# EAGLE design Reflow-A-Tron (EAGLE 7.7.0)
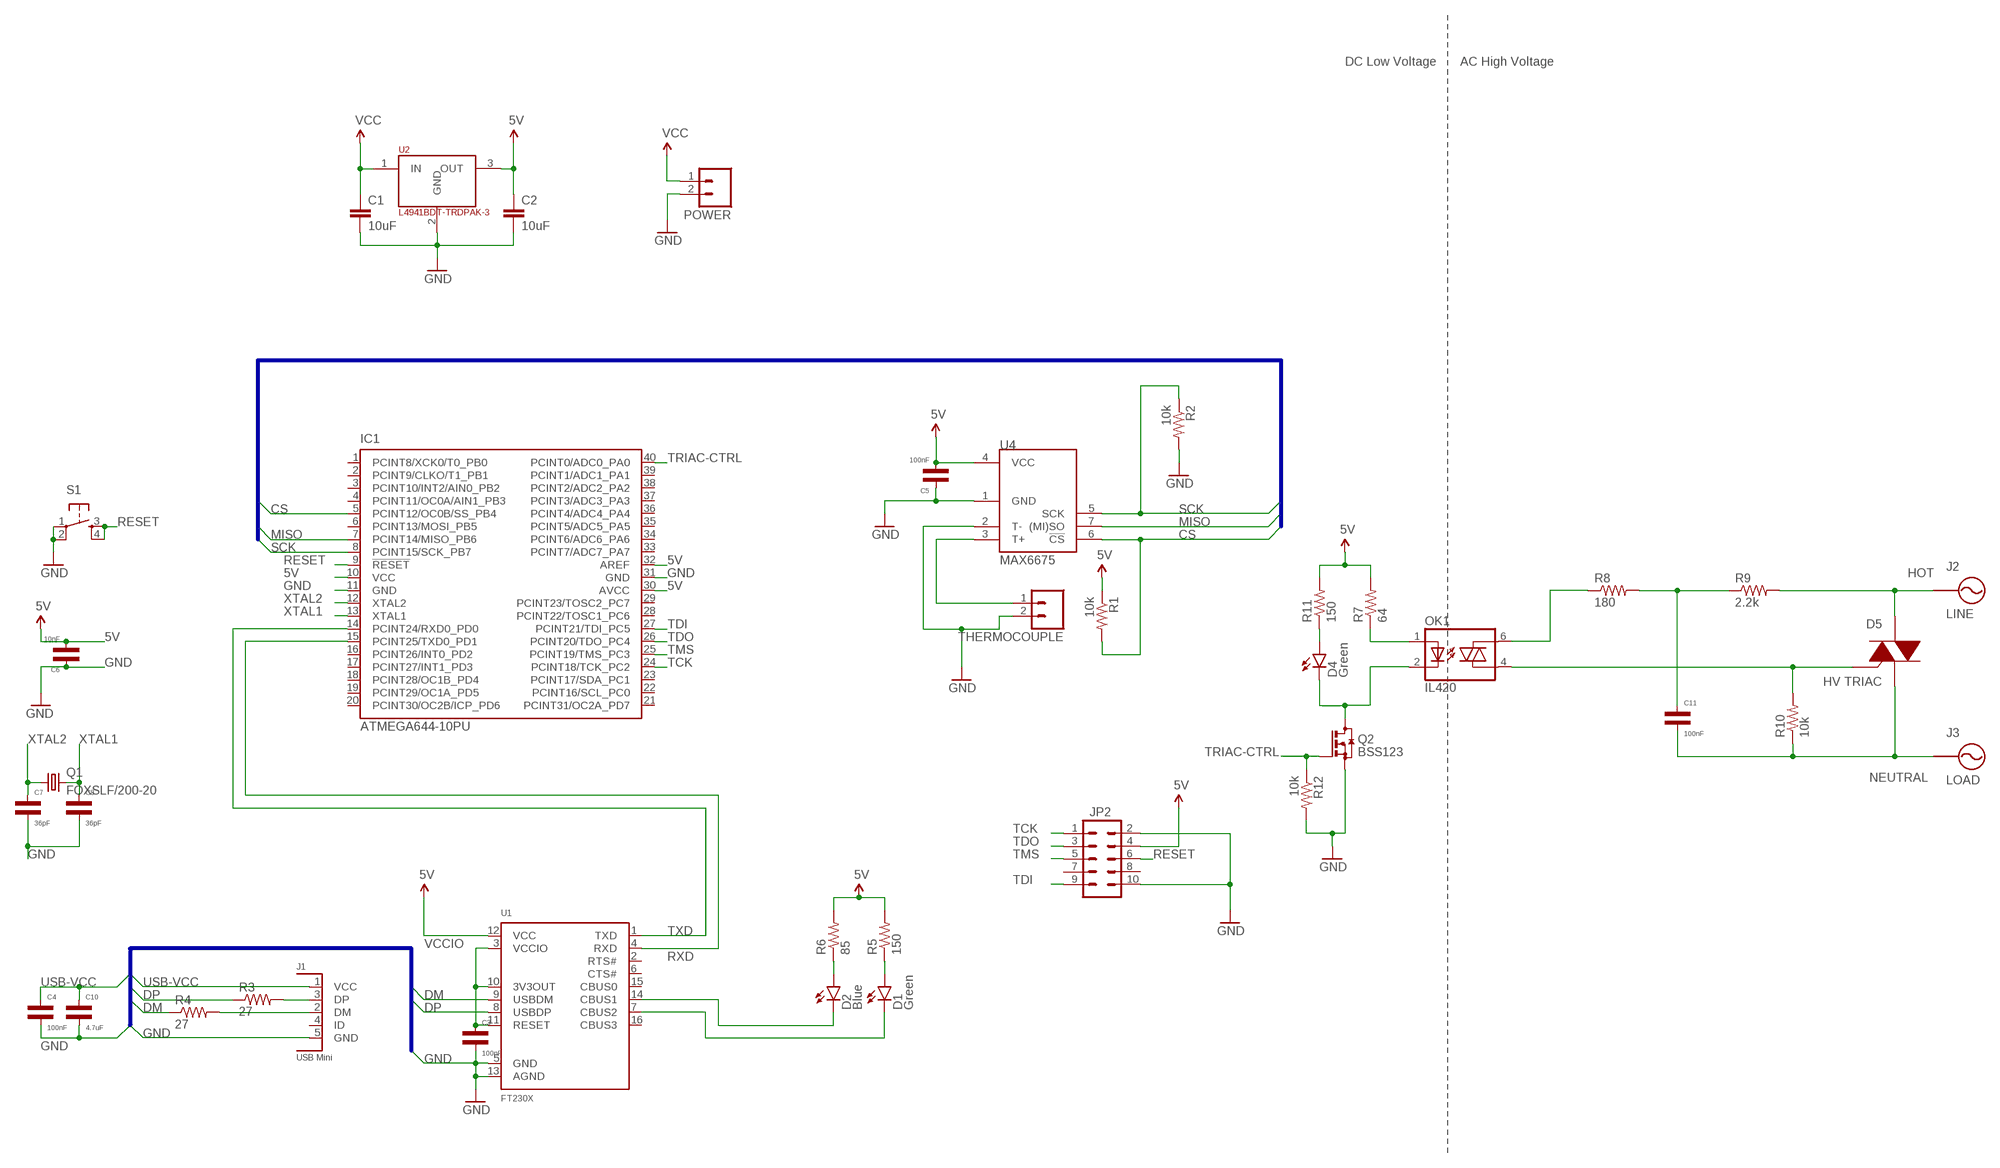
[diagram p0: schematic, sheet 1]

## Parts
C1  10uF  10UF50V20%(1210)  [1210]
C2  10uF  10UF50V20%(1210)  [1210]
C3  100nF  SMD-CAP-0805  [0805]
C4  100nF  SMD-CAP-0805  [0805]
C5  100nF  SMD-CAP-0805  [0805]
C6  10nF  SMD-CAP-0805  [0805]
C7  36pF  SMD-CAP-0805  [0805]
C8  36pF  SMD-CAP-0805  [0805]
C10  4.7uF  SMD-CAP-0805  [0805]
C11  100nF  SMD-CAP-0805  [0805]
D1  Green  LED1206  [LED-1206]
D2  Blue  LED1206  [LED-1206]
D4  Green  LED1206  [LED-1206]
D5  HV TRIAC  T1250H  [D2PAK]
IC1  ATMEGA644-10PU  [DIL40]
J1  USB Mini  XM7D-0512  [XM7D-0512]
J2  LINE  8191  [8191]
J3  LOAD  8191  [8191]
JP2  M05X2PTH  [AVR_ICSP]
OK1  IL420  [DIL06]
POWER  M025MM  [SCREWTERMINAL-5MM-2]
Q1  FOXSLF/200-20  CRYSTALHC49S  [HC49/S]
Q2  BSS123  [SOT23]
R1  10k  R-US_R0805  [R0805]
R2  10k  R-US_R0805  [R0805]
R3  27  R-US_M0805  [M0805]
R4  27  R-US_M0805  [M0805]
R5  150  R-US_R0805  [R0805]
R6  85  R-US_R0805  [R0805]
R7  64  R-US_R0805  [R0805]
R8  180  R-US_R0805  [R0805]
R9  2.2k  R-US_R0805  [R0805]
R10  10k  R-US_R0805  [R0805]
R11  150  R-US_R0805  [R0805]
R12  10k  R-US_R0805  [R0805]
S1  TAC_SWITCHPTH  [TACTILE-PTH]
THERMOCOUPLE  M023.5MM  [SCREWTERMINAL-3.5MM-2]
U1  FT230X  [SSOP-16]
U2  L4941BDT-TRDPAK-3  [DPAK]
U4  MAX6675  [SOIC8]

## Nets
5V: C2.1 C5.1 C6.1 IC1.10(VCC) IC1.30(AVCC) IC1.32(AREF) JP2.4 R1.1 R5.2 R6.2 R7.2 R11.2 U1.12(VCC) U2.3(OUT) U4.4(VCC)
CS: IC1.5(PCINT12/OC0B/SS_PB4) R1.2 U4.6(!CS)
DM: R4.1 U1.9(USBDM)
DP: R3.1 U1.8(USBDP)
GND: C1.2 C2.2 C3.1 C4.1 C5.2 C6.2 C7.1 C8.1 C10.1 IC1.11(GND) IC1.31(GND) J1.5(GND) JP2.2 JP2.10 POWER.2 Q2.2(S) R2.2 R12.2 S1.1 S1.2 THERMOCOUPLE.2 U1.5(GND) U1.13(AGND) U2.2(GND) U4.1(GND) U4.2(T-)
HOT: D5.4(A2) J2.1 J2.2 J2.3 J2.4 R9.2
MISO: IC1.7(PCINT14/MISO_PB6) U4.7((MI)SO)
N$3: J1.2(DM) R4.2
N$4: J1.3(DP) R3.2
N$5: D1.A R5.1
N$6: D2.A R6.1
N$7: D2.C U1.14(CBUS1)
N$8: D1.C U1.7(CBUS2)
N$12: OK1.6(A2) R8.1
N$13: OK1.1(A) R7.1
N$14: D5.3(G) OK1.4(A1) R10.2
N$15: C11.2 R8.2 R9.1
N$19: D4.C OK1.2(C) Q2.3(D)
N$20: D4.A R11.1
NEUTRAL: C11.1 D5.1(A1) J3.1 J3.2 J3.3 J3.4 R10.1
RESET: IC1.9(!RESET) JP2.6 S1.3 S1.4
RXD: IC1.15(PCINT25/TXD0_PD1) U1.4(RXD)
SCK: IC1.8(PCINT15/SCK_PB7) R2.1 U4.5(SCK)
T+: THERMOCOUPLE.1 U4.3(T+)
TCK: IC1.24(PCINT18/TCK_PC2) JP2.1
TDI: IC1.27(PCINT21/TDI_PC5) JP2.9
TDO: IC1.26(PCINT20/TDO_PC4) JP2.3
TMS: IC1.25(PCINT19/TMS_PC3) JP2.5
TRIAC-CTRL: IC1.40(PCINT0/ADC0_PA0) Q2.1(G) R12.1
TXD: IC1.14(PCINT24/RXD0_PD0) U1.1(TXD)
USB-VCC: C4.2 C10.2 J1.1(VCC)
VCC: C1.1 POWER.1 U2.1(IN)
VCCIO: C3.2 U1.3(VCCIO) U1.10(3V3OUT) U1.11(RESET)
XTAL1: C8.2 IC1.13(XTAL1) Q1.2
XTAL2: C7.2 IC1.12(XTAL2) Q1.1
Unconnected: IC1.1(PCINT8/XCK0/T0_PB0) IC1.2(PCINT9/CLKO/T1_PB1) IC1.3(PCINT10/INT2/AIN0_PB2) IC1.4(PCINT11/OC0A/AIN1_PB3) IC1.6(PCINT13/MOSI_PB5) IC1.16(PCINT26/INT0_PD2) IC1.17(PCINT27/INT1_PD3) IC1.18(PCINT28/OC1B_PD4) IC1.19(PCINT29/OC1A_PD5) IC1.20(PCINT30/OC2B/ICP_PD6) IC1.21(PCINT31/OC2A_PD7) IC1.22(PCINT16/SCL_PC0) IC1.23(PCINT17/SDA_PC1) IC1.28(PCINT22/TOSC1_PC6) IC1.29(PCINT23/TOSC2_PC7) IC1.33(PCINT7/ADC7_PA7) IC1.34(PCINT6/ADC6_PA6) IC1.35(PCINT5/ADC5_PA5) IC1.36(PCINT4/ADC4_PA4) IC1.37(PCINT3/ADC3_PA3) IC1.38(PCINT2/ADC2_PA2) IC1.39(PCINT1/ADC1_PA1) J1.4(ID) JP2.7 JP2.8 U1.2(RTS#) U1.6(CTS#) U1.15(CBUS0) U1.16(CBUS3)

## Buses
CS,MISO,SCK
USB-VCC,DP,DM,GND

## Notes on the sheet
- DC Low Voltage | AC High Voltage

## Library data of the parts
C1 C2 = SparkFun-Capacitors:10UF50V20%(1210): CAP-09824; PROD_ID: CAP-09824
C3 C4 C7 C8 C10 C11 = neilbetham:SMD-CAP: Unpolarized SMD Capacitor; VALUE: 10nF
C5 = custom:SMD-CAP: Unpolarized SMD Capacitor; VALUE: 10nF
C6 = custom:SMD-CAP: Unpolarized SMD Capacitor
D1 D2 D4 = SparkFun-LED:LED: LEDs Standard schematic elements and footprints for 5mm, 3mm, 1206, and 0603 sized LEDs. 5mm - Spark Fun Electronics SKU : COM-00529 (and others)
D5 = custom:T1250H: 12A RMS 600V Triac http://www.mouser.com/ProductDetail/STMicroelectronics/T1250H-6G/?qs=sGAEpiMZZMuAO0%252bGuNbnQkk12h2fQRpPEeRH2FvLW2U%3d
IC1 = atmel:ATMEGA644-*PU: 8-bit Microcontroller with 64K Bytes In-System Programmable Flash Auto generated by make-symbol-device-package-bsdl.ulp Rev. 34 Source: http://www.atmel.com/dyn/resources/prod_documents/doc2593.pdf; MPN: ATMEGA644V-10PU; OC_FARNELL: 1288342; OC_NEWARK: 23M5062
J1 = custom:XM7D-0512
J2 J3 = neilbetham:8191: Screw Terminal 6-32 Thread
JP2 = SparkFun-Connectors:M05X2: Header 5x2 Standard 10-pin dual row 0.1" header. Commonly used with AVR-ISP. Use with Spark Fun Electronics SKU: PRT-00778
OK1 = optocoupler:IL420: SIEMENS OPTO COUPLER; MF: VISHAY/TELEFUNKEN; MPN: IL420; OC_FARNELL: 1469561; OC_NEWARK: 58K1719
POWER = SparkFun-Connectors:M02: Standard 2-pin 0.1" header. Use with - straight break away headers ( PRT-00116) - right angle break away headers (PRT-00553) - swiss pins (PRT-00743) - machine pins (PRT-00117) - female headers (PRT-00115) Molex polarized connector foot print use with: PRT-08233 with associated crimp pins and housings. 2.54_SCREWTERM for use with PRT-10571. 3.5mm Screw Terminal footprints for PRT-08084 5mm Screw Terminal footprints for use with PRT-08432; STOREFRONT_ID: PRT-08432
Q1 = crystal:CRYSTAL: CRYSTAL; OC_FARNELL: 1667008; OC_NEWARK: unknown
Q2 = transistor-small-signal:BSS123: N-CHANNEL MOS FET
R1-R12 = resistor:R-US_: RESISTOR, American symbol
S1 = SparkFun-Retired:TAC_SWITCH: Momentary Switch Button commonly used for reset or general input. Spark Fun Electronics SKU : COM-00097 SMT- SWCH-08247
THERMOCOUPLE = SparkFun-Connectors:M02: Standard 2-pin 0.1" header. Use with - straight break away headers ( PRT-00116) - right angle break away headers (PRT-00553) - swiss pins (PRT-00743) - machine pins (PRT-00117) - female headers (PRT-00115) Molex polarized connector foot print use with: PRT-08233 with associated crimp pins and housings. 2.54_SCREWTERM for use with PRT-10571. 3.5mm Screw Terminal footprints for PRT-08084 5mm Screw Terminal footprints for use with PRT-08432; PROD_ID: CONN-08399
U1 = custom:FT230X
U2 = neilbetham:L4941BDT-TR: 5V 1A Voltage Regulator. Input max voltage of 16V. Dropout voltage .25v @ 500mA
U4 = SparkFun-AnalogIC:MAX6675: Cold-Junction-Compensated K-Thermocoupleto-Digital Converter (0°C to +1024°C) The MAX6675 performs cold-junction compensation and digitizes the signal from a type-K thermocouple. The data is output in a 12-bit resolution, SPI™-compatible, read-only format. This converter resolves temperatures to 0.25°C, allows readings as high as +1024°C, and exhibits thermocouple accuracy of 8LSBs for temperatures ranging from 0°C to +700°C.; PROD_ID: IC-12512

## Board
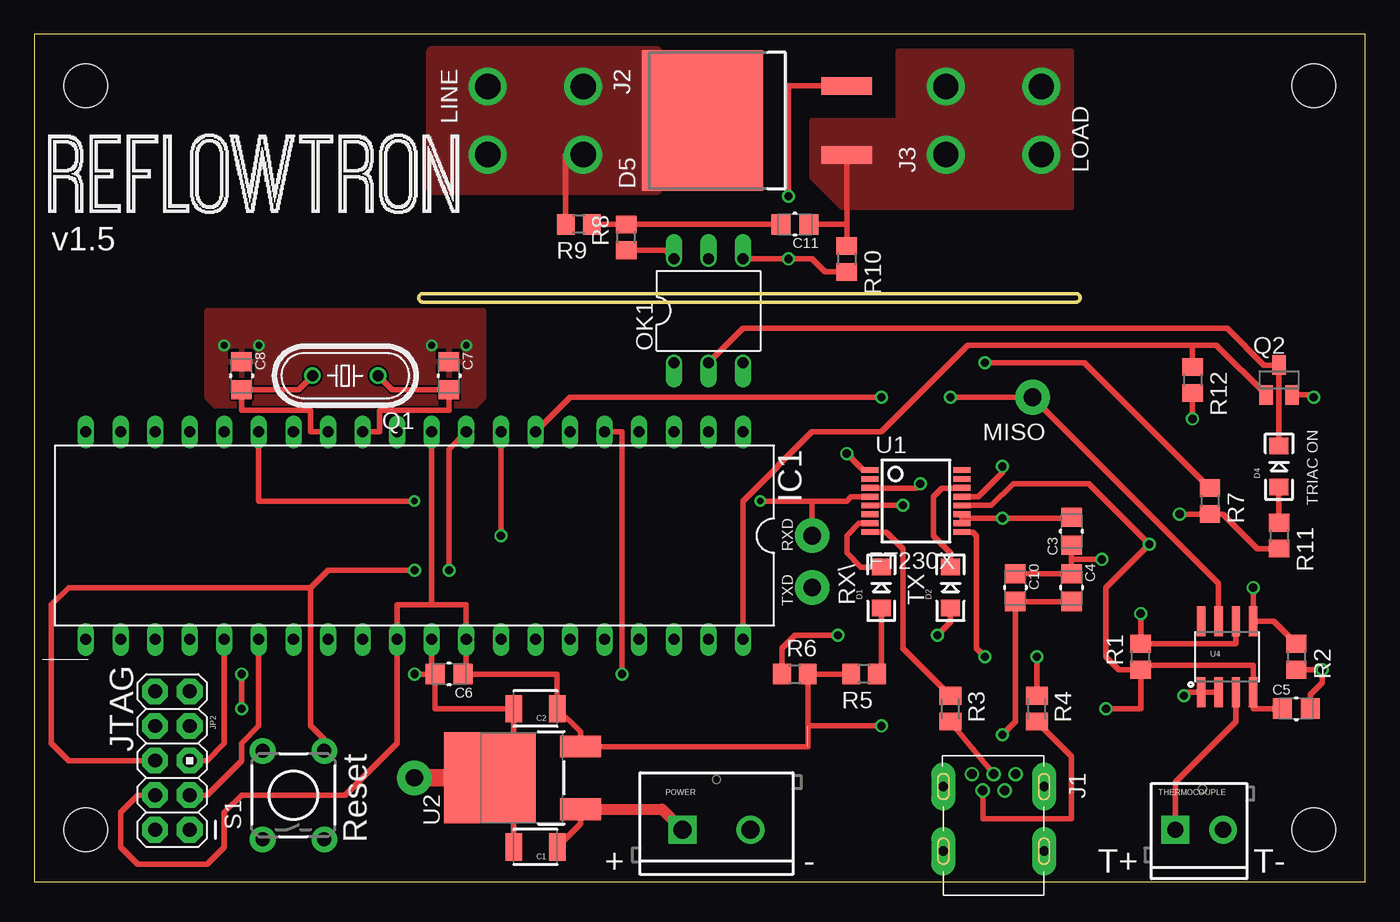
[diagram p1: board, top side]
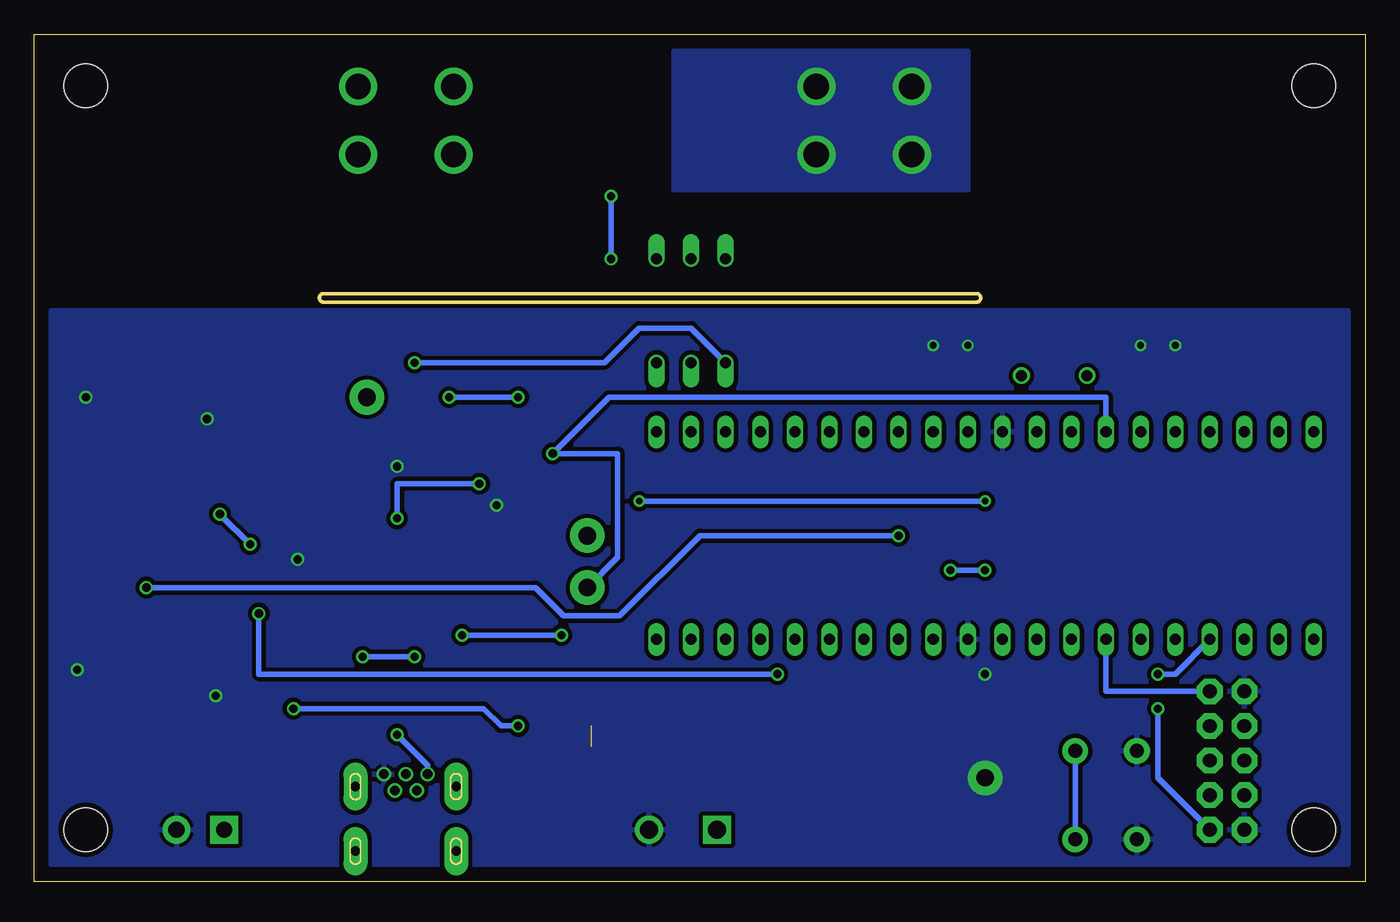
[diagram p2: board, bottom side, seen from below]

Size 97.79 x 62.23 mm. Coordinates in mm from the lower left corner, seen from the top.
Outline: 0,0 97.79,0 97.79,62.23 0,62.23 0,0
Copper layers (1*16): Top 0.0356mm / dielectric 1.5011mm / Bottom 0.0356mm
Design rules "oshpark *": minimum track width 6mil, minimum drill 13mil, track to track 6mil, track to pad 6mil, pad to pad 6mil, via to via 6mil, smd to smd 6mil, copper to edge 15mil, drill to drill 6mil, minimum pad ring 7mil, minimum via ring 7mil, stop-mask expansion 3mil, vias tented up to drill 25mil, thermal gap 10mil
Holes 3.2 mm at 3.81,58.42 93.98,58.42 3.81,3.81 93.98,3.81
Milling: 6 lines

### Footprints (pad centres in the part's own frame; a part is rotated, then mirrored left to right if it is on the bottom)
1210 = smd 1.2 x 2: 1 -1.6,0; 2 1.6,0
0805 = smd 1.4 x 1.5: 1 -1.025,0; 2 1.025,0
LED-1206 = smd 1.2 x 1.4: A -1.5,0; C 1.5,0
D2PAK = smd 1.3 x 3.7: 1 -2.54,0; 3 2.54,0 | smd 10.3 x 8.9: 4 0,10.6
DIL40 = drill 0.813 long: 1 -24.13,-7.62; 2 -21.59,-7.62; 3 -19.05,-7.62; 4 -16.51,-7.62; 5 -13.97,-7.62; 6 -11.43,-7.62; 7 -8.89,-7.62; 8 -6.35,-7.62; 9 -3.81,-7.62; 10 -1.27,-7.62; 11 1.27,-7.62; 12 3.81,-7.62; 13 6.35,-7.62; 14 8.89,-7.62; 15 11.43,-7.62; 16 13.97,-7.62; 17 16.51,-7.62; 18 19.05,-7.62; 19 21.59,-7.62; 20 24.13,-7.62; 21 24.13,7.62; 22 21.59,7.62; 23 19.05,7.62; 24 16.51,7.62; 25 13.97,7.62; 26 11.43,7.62; 27 8.89,7.62; 28 6.35,7.62; 29 3.81,7.62; 30 1.27,7.62; 31 -1.27,7.62; 32 -3.81,7.62; 33 -6.35,7.62; 34 -8.89,7.62; 35 -11.43,7.62; 36 -13.97,7.62; 37 -16.51,7.62; 38 -19.05,7.62; 39 -21.59,7.62; 40 -24.13,7.62
XM7D-0512 = drill 0.7: 1 1.6,-0.9; 2 0.8,0.3; 3 0,-0.9; 4 -0.8,0.3; 5 -1.6,-0.9 | drill 0.7 pad 1.778 long: P$6 3.7,0; P$7 -3.7,0.01; P$8 3.7,4.75; P$9 -3.7,4.75
8191 = drill 1.854: 1 -2.502,3.505; 2 2.502,3.505; 3 -2.502,-3.505; 4 2.502,-3.505
AVR_ICSP = drill 1.016 pad 1.88 octagon: 1 -1.27,5.08; 2 1.27,5.08; 3 -1.27,2.54; 4 1.27,2.54; 5 -1.27,0; 6 1.27,0; 7 -1.27,-2.54; 8 1.27,-2.54; 9 -1.27,-5.08; 10 1.27,-5.08
DIL06 = drill 0.813 offset: 1 -2.54,-3.81; 2 0,-3.81; 3 2.54,-3.81; 4 2.54,3.81; 5 0,3.81; 6 -2.54,3.81
SCREWTERMINAL-5MM-2 = drill 1.3 pad 2.032 square: 1 0,0 | drill 1.3 pad 2.032: 2 5,0
HC49/S = drill 0.813: 1 -2.413,0; 2 2.413,0
SOT23 = smd 1 x 1.4: 1 -0.95,-1.1; 2 0.95,-1.1; 3 0,1.1
R0805 = smd 1.3 x 1.5: 1 -0.95,0; 2 0.95,0
M0805 = smd 1.3 x 1.6: 1 -0.95,0; 2 0.95,0
TACTILE-PTH = drill 1.016 pad 1.88: 1 -3.251,2.261; 2 3.251,2.261; 3 -3.251,-2.261; 4 3.251,-2.261
SCREWTERMINAL-3.5MM-2 = drill 1.2 pad 2.032 square: 1 0,0 | drill 1.2 pad 2.032: 2 3.5,0
SSOP-16 = smd 0.42 x 1.25: 1 -2.275,-3.375; 2 -1.625,-3.375; 3 -0.975,-3.375; 4 -0.325,-3.375; 5 0.325,-3.375; 6 0.975,-3.375; 7 1.625,-3.375; 8 2.275,-3.375; 9 2.275,3.375; 10 1.625,3.375; 11 0.975,3.375; 12 0.325,3.375; 13 -0.325,3.375; 14 -0.975,3.375; 15 -1.625,3.375; 16 -2.275,3.375
DPAK = smd 1.6 x 3: 1 -2.3,-3.3; 3 2.3,-3.3 | smd 6.7 x 6.7: 2 0,3.35
SOIC8 = smd 0.61 x 2.21: 1 -1.905,-2.616; 2 -0.635,-2.616; 3 0.635,-2.616; 4 1.905,-2.616; 5 1.905,2.616; 6 0.635,2.616; 7 -0.635,2.616; 8 -1.905,2.616

### Placement (x,y rotation side)
C1  36.83,2.54 180 top
C2  36.83,12.7 180 top
C3  76.2,25.72 90 top
C4  76.2,21.59 270 top
C5  92.71,12.7 0 top
C6  30.48,15.24 180 top
C7  30.48,37.15 270 top
C8  15.24,37.15 270 top
C10  72.07,21.59 270 top
C11  55.88,48.26 180 top
D1  62.23,21.59 90 top
D2  67.31,21.59 90 top
D4  91.44,30.48 90 top
D5  59.69,55.88 90 top
IC1  27.94,25.4 180 top
J1  70.48,6.99 180 top
J2  36.83,55.88 270 top
J3  70.48,55.88 90 top
JP2  10.16,8.89 180 top
OK1  49.53,41.91 0 top
POWER  47.62,3.81 0 top
Q1  22.86,37.15 180 top
Q2  91.44,36.83 0 top
R1  81.28,16.51 90 top
R2  92.71,16.51 270 top
R3  67.31,12.7 270 top
R4  73.66,12.7 270 top
R5  60.96,15.24 180 top
R6  55.88,15.24 0 top
R7  86.36,27.94 270 top
R8  43.5,47.31 90 top
R9  40.01,48.26 180 top
R10  59.69,45.72 270 top
R11  91.44,25.4 270 top
R12  85.09,36.83 270 top
S1  19.05,6.35 90 top
THERMOCOUPLE  83.82,3.81 0 top
U1  64.77,27.94 270 top
U2  36.83,7.62 90 top
U4  87.63,16.51 0 top

### Tracks (layer width: path | path; a pad name or v marks a point on that pad's centre or on a via)
5V  (via drill 0.6, 0.6 pad 0.41)  (2 unrouted)
  Top 0.406: R5.2 R6.2 56.83,9.92 U2.3 40.13,11 C2.1 38.43,15.24 C6.1 31.75,15.24 IC1.32 31.75,20.32 29.21,20.32 | R11.2 89.85,24.45 87.31,26.99 R7.2 v84.14,26.99 | 29.21,20.32 26.67,20.32 IC1.30 26.67,10.16 22.86,6.35 15.24,6.35 13.97,5.08 13.97,2.54 12.7,1.27 7.62,1.27 6.35,2.54 6.35,5.08 7.62,6.35 JP2.4 | IC1.10 29.21,20.32 | 89.61,13.97 U4.4 | U4.4 89.53,12.7 C5.1 | U1.12 68.15,27.62 70.33,27.62 71.91,29.21 77.47,29.21 v81.92,24.77 78.74,21.59 78.74,16.51 79.69,15.56 R1.1 81.28,15.88 89.53,15.88 U4.4 | 56.83,11.43 v62.23,11.43 | v78.74,12.7 81.28,12.7 R1.1
  Bottom 0.406: v81.92,24.77 v84.14,26.99 | v62.23,11.43 63.5,11.43 64.77,12.7 v78.74,12.7
CS  (via drill 0.6)
  Top 0.406: U4.6 88.27,17.46 R1.2 v81.28,19.68 | v43.18,15.24 43.18,33.02 IC1.5
  Bottom 0.406: v81.28,19.68 81.28,15.24 v43.18,15.24
DM  (via drill 0.6 pad 0.41)
  Top 0.406: U1.9 68.95,25.66 69.22,25.4 69.22,17.14 v69.85,16.51 | v73.66,16.51 R4.1
  Bottom 0.406: v69.85,16.51 v73.66,16.51
DP
  Top 0.406: U1.8 62.6,25.66 63.82,24.45 63.82,17.14 R3.1
GND  (via drill 0.5 pad 0.81, 0.6, 0.6 pad 0.41, 1.27 pad 2.54)
  Top 0.406: C1.2 35.23,6.35 34.29,6.35 34.29,7.62 U2.2 | U2.2 arc90 35.23,9.37 C2.2 29.45,12.7 C6.2 | 32.21,6.35 U2.2 | 31.75,7.62 U2.2 | U1.5 v63.82,27.62 | 72.07,22.54 C10.1 C4.1 76.2,23.65 | C6.2 v27.94,15.24 | C6.2 29.21,15.24 IC1.31 | C5.2 93.73,13.72 94.61,14.61 v94.61,15.56 R2.2 | v84.45,13.65 84.7,13.89 U4.1 U4.2 | Q2.2 93.81,35.73 v93.98,35.56 | R12.2 v85.09,33.97 | 76.2,23.65 C3.1 | U1.13 68.15,28.26 69.37,28.26 71.12,30 v71.12,30.48 | v78.42,23.65 76.2,23.65
  Top 1.27: v27.94,7.62 31.75,7.62
  other vias: 16.51,39.37 29.21,39.37 13.97,39.37 31.75,39.37
  pour Bottom (isolate 0.305): 1.27,1.27 96.52,1.27 96.52,41.91 1.27,41.91
  pour Top: 12.7,41.91 33.02,41.91 33.02,35.56 32.38,34.92 13.34,34.92 12.7,35.56
HOT
  Top 0.406: R9.2 39.05,53.38 J2.2
  pour Top (isolate 0.305, no thermals): 29.21,60.96 45.72,60.96 45.72,50.8 29.21,50.8
  pour Bottom: 29.21,60.96 50.8,50.8 29.21,50.8
  pour Bottom (no thermals): 29.21,60.96 50.8,60.96 50.8,50.8 29.21,50.8
MISO  (via drill 0.6 pad 0.41, 1.3 pad 2.54)
  Top 0.406: U4.7 87,21.91 v73.34,35.56 v67.31,35.56 | v62.23,35.56 39.37,35.56 IC1.7
  Bottom 0.406: v67.31,35.56 v62.23,35.56
N$3
  Top 0.406: J1.2 69.69,4.6 76.2,4.6 76.2,9.21 R4.2
N$4
  Top 0.406: J1.3 R3.2
N$5
  Top 0.406: D1.A 62.23,15.56 R5.1
N$6  (via drill 0.6 pad 0.41)
  Top 0.406: D2.A 67.31,19.05 v66.36,18.1 | v59.05,18.1 55.88,18.1 54.93,17.14 R6.1
  Bottom 0.406: v66.36,18.1 v59.05,18.1
N$7
  Top 0.406: D2.C 67.31,24.13 66.04,25.4 66.04,28.26 66.67,28.89 68.12,28.89 U1.14
N$8
  Top 0.406: U1.7 60.6,26.32 59.69,25.4 59.69,24.13 60.73,23.09 D1.C
N$12
  Top 0.406: OK1.6 46.35,46.36 R8.1
N$13  (via drill 0.6 pad 0.41)
  Top 0.406: R7.1 77.15,38.1 v69.85,38.1
  Bottom 0.406: v69.85,38.1 55.88,38.1 53.34,40.64 49.53,40.64 OK1.1
N$14  (via drill 0.6)
  Top 0.406: R10.2 58.1,44.77 57.15,45.72 v55.4,45.72 OK1.4 | v55.4,50.32 55.4,58.42 D5.3
  Bottom 0.406: v55.4,50.32 v55.4,45.72
N$15
  Top 0.406: C11.2 R8.2 R9.1
N$19
  Top 0.406: OK1.2 52.07,40.64 87.63,40.64 90.34,37.93 Q2.3 D4.C
N$20
  Top 0.406: R11.1 D4.A
NEUTRAL
  Top 0.406: R10.1 59.69,48.26 | 59.69,48.26 C11.1 | 59.69,48.26 D5.1
  pour Top (no thermals): 76.2,60.96 63.5,60.96 63.5,55.88 57.15,55.88 57.15,51.75 59.37,49.53 76.2,49.53
RESET  (via drill 0.6 pad 0.41)
  Top 0.406: IC1.9 30.48,31.75 v30.48,22.86 | 20.32,21.59 20.32,11.43 21.31,10.44 S1.4 | 20.32,21.59 2.54,21.59 1.27,20.32 1.27,10.16 2.54,8.89 JP2.6 | 20.32,21.59 21.59,22.86 v27.94,22.86
  Bottom 0.406: S1.4 S1.3 | v30.48,22.86 v27.94,22.86
RXD  (via drill 0.5 pad 0.81, 1.3 pad 2.54)
  Top 0.406: IC1.15 16.51,27.94 v27.94,27.94 | v53.34,27.94 57.15,27.94 | 57.15,27.94 59.69,27.94 60.02,28.27 U1.4 | 57.15,27.94 v57.15,25.4
  Bottom 0.406: v27.94,27.94 v53.34,27.94
SCK  (via drill 0.6)
  Top 0.406: R2.1 91.04,19.13 U4.5 v89.53,21.59 | v34.29,25.4 IC1.8
  Bottom 0.406: v89.53,21.59 60.96,21.59 58.9,19.53 54.77,19.53 48.9,25.4 v34.29,25.4
T+
  Top 0.406: THERMOCOUPLE.1 83.82,7.3 88.27,11.75 U4.3
TCK  (via drill 0.6)
  Top 0.406: v15.24,12.7 v15.24,15.24
  Bottom 0.406: JP2.1 15.24,7.62 v15.24,12.7 | IC1.24 13.97,15.24 v15.24,15.24
TDI
  Bottom 0.406: JP2.9 19.05,13.97 IC1.27
TDO
  Top 0.406: JP2.3 12.7,6.35 15.24,8.89 15.24,10.16 16.51,11.43 IC1.26
TMS
  Top 0.406: JP2.5 12.7,8.89 13.97,10.16 IC1.25
TRIAC-CTRL
  Top 0.406: Q2.1 86.85,39.37 85.09,39.37 | 85.09,39.37 68.58,39.37 62.23,33.02 57.15,33.02 52.07,27.94 IC1.40 | R12.1 85.09,39.37
TXD  (via drill 0.6 pad 0.41, 1.3 pad 2.54)
  Top 0.406: U1.1 60.91,30.21 v59.69,31.43
  Bottom 0.406: IC1.14 19.05,35.56 55.56,35.56 v59.69,31.43 54.93,31.43 54.93,23.81 v57.15,21.59
USB-VCC  (via drill 0.6)
  Top 0.406: C4.2 C10.2 72.07,11.75 v71.12,10.79
  Bottom 0.406: J1.1 68.89,8.56 v71.12,10.79
VCC
  Top 0.406: U2.1 40.13,4.24 C1.1
  Top 0.813: U2.1 46.12,5.32 POWER.1
VCCIO  (via drill 0.6)
  Top 0.406: U1.10 U1.11 68.44,26.67 v71.12,26.67 76.13,26.67 arc90 C3.2 | U1.3 61.42,28.89 64.77,28.89 v65.09,29.21
  Bottom 0.406: v65.09,29.21 71.12,29.21 v71.12,26.67
XTAL1
  Top 0.406: Q1.2 19.42,36.12 C8.2 15.24,34.61 20.32,34.61 20.32,33.02 IC1.13
XTAL2
  Top 0.406: IC1.12 25.4,33.02 25.4,34.61 30.48,34.61 C7.2 26.3,36.12 Q1.1

### Text on the board
tPlace: v1.5 | TRIAC ON | RX\ | TX | JTAG | Reset | + | - | T+ | T-
bPlace: C:/Users/Neil/eagle-stuff/Reflow-A-Tron/ReflowTron.bmp
tNames: MISO | RXD | TXD
201bmp: C:/Users/Neil/eagle-stuff/Reflow-A-Tron/ReflowTron.bmp